# Altium schematic sheet 基于STM32的DDS信号源.SchDoc
size A4
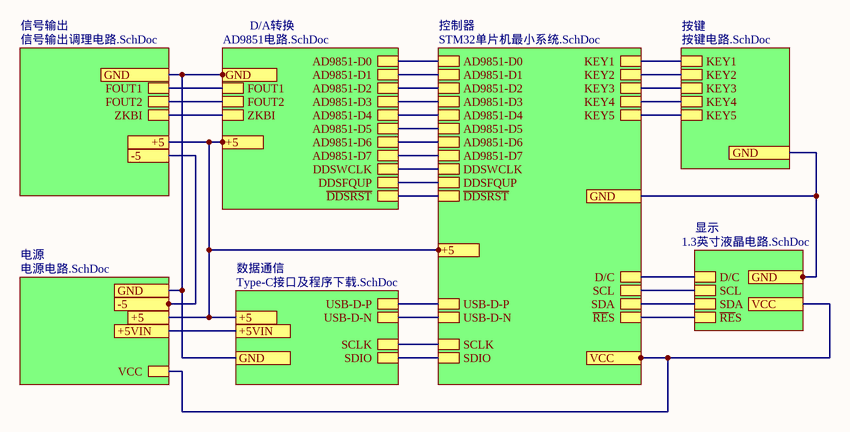
[diagram p0: 基于STM32的DDS信号源.SchDoc]

## Sub-sheets
D/A转换 = AD9851电路.SchDoc: AD9851-D0, AD9851-D1, AD9851-D2, AD9851-D3, AD9851-D4, AD9851-D5, AD9851-D6, AD9851-D7, DDSWCLK, DDSFQUP, ~{DDSRST}, FOUT1, FOUT2, ZKBI, GND, +5
信号输出 = 信号输出调理电路.SchDoc: FOUT1, FOUT2, ZKBI
按键 = 按键电路.SchDoc: KEY1, KEY2, KEY3, KEY4, KEY5
控制器 = STM32单片机最小系统.SchDoc: KEY3, KEY4, KEY5, KEY1, KEY2, D/C, SCL, SDA, ~{RE}S, AD9851-D0, AD9851-D1, AD9851-D2, AD9851-D3, AD9851-D4, AD9851-D5, AD9851-D6, AD9851-D7, DDSWCLK, DDSFQUP, ~{DDSRST}, USB-D-P, USB-D-N, SCLK, SDIO, +5, VCC
数据通信 = Type-C接口及程序下载.SchDoc: USB-D-P, USB-D-N, SCLK, SDIO
显示 = 1.3英寸液晶电路.SchDoc: ~{RE}S, SDA, SCL, D/C, GND
电源 = 电源电路.SchDoc: VCC, -5

## Ports
+5, +5VIN, -5, GND, VCC

## Nets
+5: port +5, sheet 控制器/+5, sheet D/A转换/+5
-5: port -5, sheet 电源/-5
GND: port GND, sheet 显示/GND, sheet D/A转换/GND
VCC: port VCC, sheet 控制器/VCC, sheet 电源/VCC
(unnamed): sheet 按键/KEY1, sheet 控制器/KEY1
(unnamed): sheet 按键/KEY2, sheet 控制器/KEY2
(unnamed): sheet 按键/KEY3, sheet 控制器/KEY3
(unnamed): sheet 按键/KEY4, sheet 控制器/KEY4
(unnamed): sheet 按键/KEY5, sheet 控制器/KEY5
(unnamed): sheet 显示/~{RE}S, sheet 控制器/~{RE}S
(unnamed): sheet 显示/SDA, sheet 控制器/SDA
(unnamed): sheet 显示/SCL, sheet 控制器/SCL
(unnamed): sheet 显示/D/C, sheet 控制器/D/C
(unnamed): sheet 控制器/AD9851-D0, sheet D/A转换/AD9851-D0
(unnamed): sheet 控制器/AD9851-D1, sheet D/A转换/AD9851-D1
(unnamed): sheet 控制器/AD9851-D2, sheet D/A转换/AD9851-D2
(unnamed): sheet 控制器/AD9851-D3, sheet D/A转换/AD9851-D3
(unnamed): sheet 控制器/AD9851-D4, sheet D/A转换/AD9851-D4
(unnamed): sheet 控制器/AD9851-D5, sheet D/A转换/AD9851-D5
(unnamed): sheet 控制器/AD9851-D6, sheet D/A转换/AD9851-D6
(unnamed): sheet 控制器/AD9851-D7, sheet D/A转换/AD9851-D7
(unnamed): sheet 控制器/DDSWCLK, sheet D/A转换/DDSWCLK
(unnamed): sheet 控制器/DDSFQUP, sheet D/A转换/DDSFQUP
(unnamed): sheet 控制器/~{DDSRST}, sheet D/A转换/~{DDSRST}
(unnamed): sheet 控制器/USB-D-P, sheet 数据通信/USB-D-P
(unnamed): sheet 控制器/USB-D-N, sheet 数据通信/USB-D-N
(unnamed): sheet 控制器/SCLK, sheet 数据通信/SCLK
(unnamed): sheet 控制器/SDIO, sheet 数据通信/SDIO
(unnamed): sheet D/A转换/FOUT1, sheet 信号输出/FOUT1
(unnamed): sheet D/A转换/FOUT2, sheet 信号输出/FOUT2
(unnamed): sheet D/A转换/ZKBI, sheet 信号输出/ZKBI